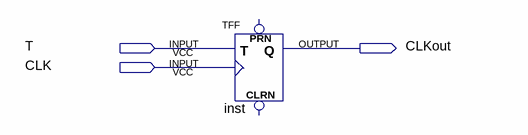
[diagram p0: schematic sheet]
// Quartus schematic FFT.bdf as structural Verilog: 1 symbols, 3 pins
module FFT (
  input  T,
  input  CLK,
  output CLKout
);

  TFF inst (.T(T), .CLK(CLK), .Q(CLKout));  // open: PRN, CLRN
endmodule
